# Altium schematic sheet CheetahStack.SchDoc: Title
size Letter; Engineer: David Simmons; Organization: SPAWAR Systems Center Pacific; Address1: 3 Minna Close; Address2: Belrose; Address3: NSW 2085; Address4: Australia; Revision: 1; SheetNumber: 1; SheetTotal: 1; PageSetup: Record=PageOptions|CenterHorizontal=True|CenterVertical=True|PrintScale=0.94|XCorrection=1.00|YCorrection=1.00|PrintKind=0|BorderSize=5000000|LeftOffset=0|BottomOffset=0|Orientation=2|PaperLength=1000|PaperWidth=1000|Scale=100|PaperSource=15|PrintQuality=-3|MediaType=1|DitherType=10|PrintScaleMode=1|PaperKind=A3|PaperIndex=8
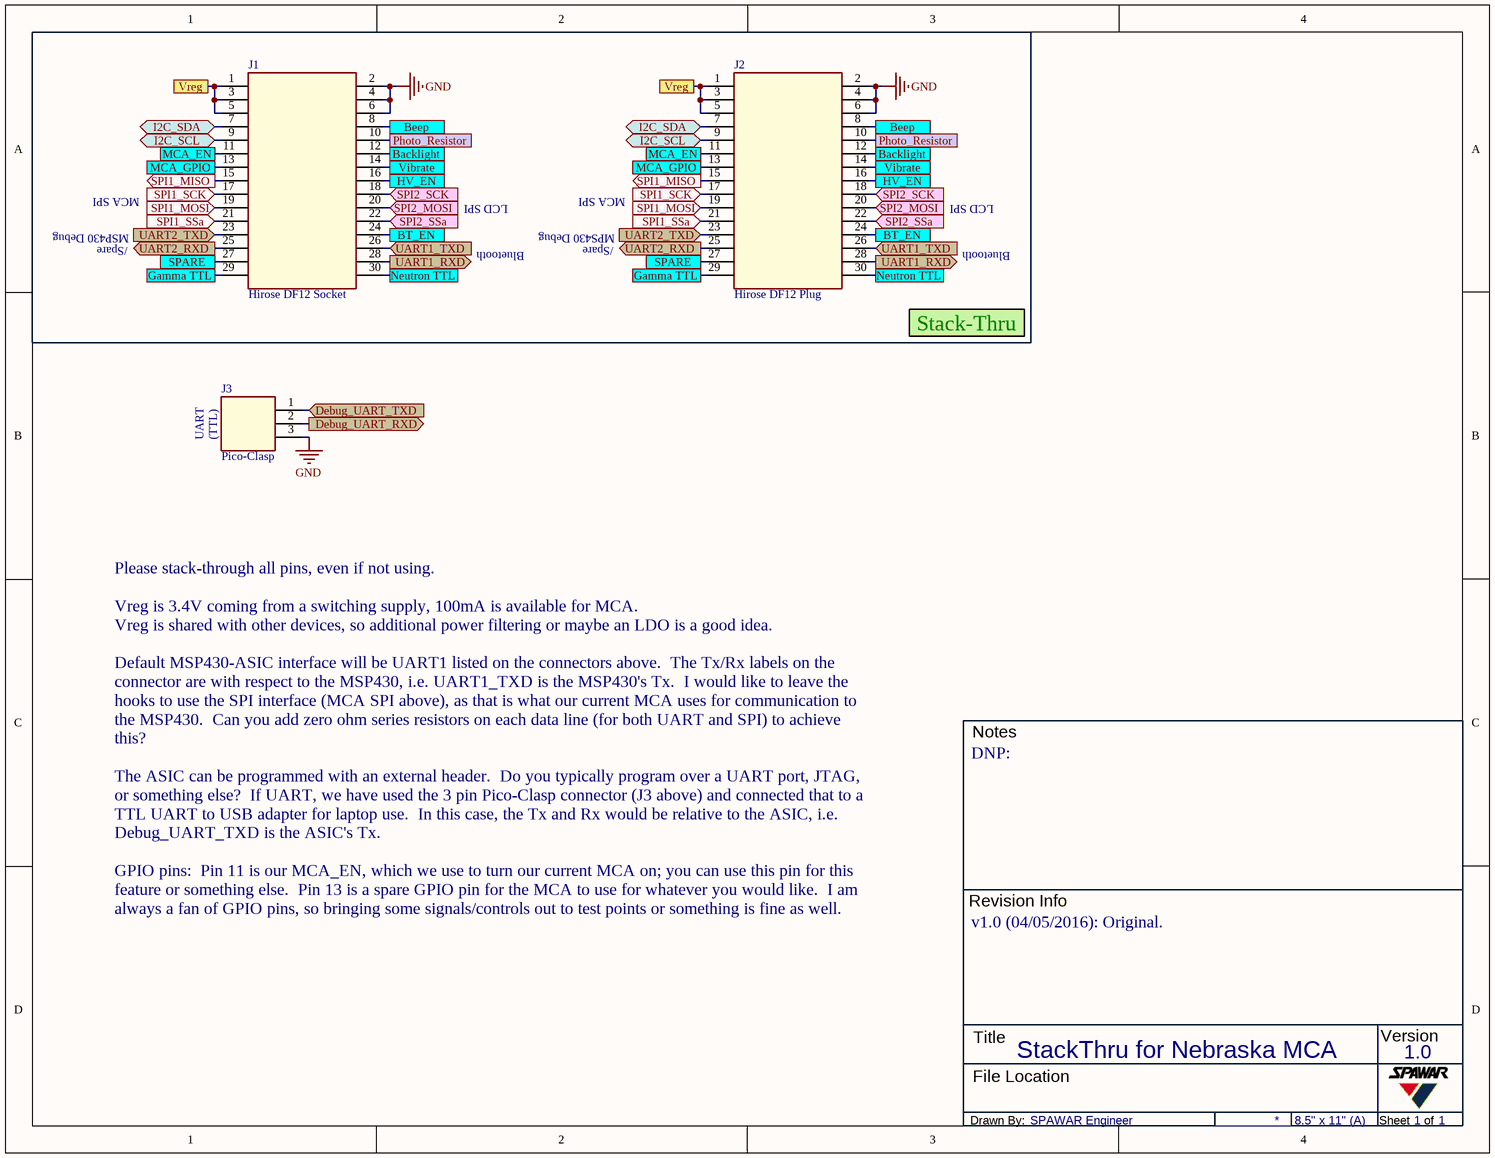
[diagram p0: CheetahStack.SchDoc]

## Parts
J1  Hirose DF12 Socket  [DF12B-30DS-0.5V(86)]
J2  Hirose DF12 Plug  [DF12B(5.0)-30DP-0.5V(86)]
J3  Pico-Clasp  [Molex 1x3 Pin, Pico-Clasp]

## Ports
Backlight, Beep, BT_EN, Debug_UART_RXD, Debug_UART_TXD, Gamma TTL, HV_EN, I2C_SCL, I2C_SDA, MCA_EN, MCA_GPIO, Neutron TTL, Photo_Resistor, SPARE, SPI1_MISO, SPI1_MOSI, SPI1_SCK, SPI1_SSa, SPI2_MOSI, SPI2_SCK, SPI2_SSa, UART1_RXD, UART1_TXD, UART2_RXD, UART2_TXD, Vibrate, Vreg

## Nets
GND: J1.2 J1.4 J1.6 J2.2 J2.4 J2.6 J3.3
Backlight: J1.12 J2.12 ; port Backlight
Beep: J1.8 J2.8 ; port Beep
BT_EN: J1.24 J2.24 ; port BT_EN
Debug_UART_RXD: J3.2 ; port Debug_UART_RXD
Debug_UART_TXD: J3.1 ; port Debug_UART_TXD
Gamma TTL: J1.29 J2.29 ; port Gamma TTL
HV_EN: J1.16 J2.16 ; port HV_EN
I2C_SCL: J1.9 J2.9 ; port I2C_SCL
I2C_SDA: J1.7 J2.7 ; port I2C_SDA
MCA_EN: J1.11 J2.11 ; port MCA_EN
MCA_GPIO: J1.13 J2.13 ; port MCA_GPIO
Neutron TTL: J1.30 J2.30 ; port Neutron TTL
Photo_Resistor: J1.10 J2.10 ; port Photo_Resistor
SPARE: J1.27 J2.27 ; port SPARE
SPI1_MISO: J1.15 J2.15 ; port SPI1_MISO
SPI1_MOSI: J1.19 J2.19 ; port SPI1_MOSI
SPI1_SCK: J1.17 J2.17 ; port SPI1_SCK
SPI1_SSa: J1.21 J2.21 ; port SPI1_SSa
SPI2_MOSI: J1.20 J2.20 ; port SPI2_MOSI
SPI2_SCK: J1.18 J2.18 ; port SPI2_SCK
SPI2_SSa: J1.22 J2.22 ; port SPI2_SSa
UART1_RXD: J1.28 J2.28 ; port UART1_RXD
UART1_TXD: J1.26 J2.26 ; port UART1_TXD
UART2_RXD: J1.25 J2.25 ; port UART2_RXD
UART2_TXD: J1.23 J2.23 ; port UART2_TXD
Vibrate: J1.14 J2.14 ; port Vibrate
Vreg: J1.1 J1.3 J1.5 J2.1 J2.3 J2.5 ; port Vreg

## Notes on the sheet
- MSP430 Debug
- MCA SPI
- LCD SPI
- MPS430 Debug
- /Spare
- Bluetooth
- Stack-Thru
- UART
- (TTL)
- Notes
- DNP:
- Revision Info
- Please stack-through all pins, even if not using.
  Vreg is 3.4V coming from a switching supply, 100mA is available for MCA.
  Vreg is shared with other devices, so additional power filtering or maybe an LDO is a good idea.
  Default MSP430-ASIC interface will be UART1 listed on the connectors above.  The Tx/Rx labels on the connector are with respect to the MSP430, i.e. UART1_TXD is the MSP430's Tx.  I would like to leave the hooks to use the SPI interface (MCA SPI above), as that is what our current MCA uses for communication to the MSP430.  Can you add zero ohm series resistors on each data line (for both UART and SPI) to achieve this?
  The ASIC can be programmed with an external header.  Do you typically program over a UART port, JTAG, or something else?  If UART, we have used the 3 pin Pico-Clasp connector (J3 above) and connected that to a TTL UART to USB adapter for laptop use.  In this case, the Tx and Rx would be relative to the ASIC, i.e. Debug_UART_TXD is the ASIC's Tx.
  GPIO pins:  Pin 11 is our MCA_EN, which we use to turn our current MCA on; you can use this pin for this feature or something else.  Pin 13 is a spare GPIO pin for the MCA to use for whatever you would like.  I am always a fan of GPIO pins, so bringing some signals/controls out to test points or something is fine as well.
- v1.0 (04/05/2016): Original.
- Title
- StackThru for Nebraska MCA
- 1.0
- Version
- Drawn By:
- SPAWAR Engineer
- File Location
- 8.5" x 11" (A)
- Sheet
- 1
- of

## Library data of the parts
J1 = Conn, Hirose, 2x15 Pin, DF12, Socket, Vert, SMT, with metal fitting: Dist Part: 798-DF12B30DS05V86; Cost ($): 1.24; Manufacturer: Hirose; Manf Part: DF12B-30DS-0.5V(86); Distributor: Mouser
J2 = Conn, Hirose, 2x15 Pin, DF12, Plug, Vert, SMT, 5.0mm, with metal fitting: Dist Part: 798-DF12B5030DP05V86; Cost ($): 1.49; Manufacturer: Hirose; Manf Part: DF12B(5.0)-30DP-0.5V(86); Distributor: Mouser
J3 = Conn, Molex, 1x3 Pin, Pico-Clasp, Horz: Dist Part: WM7894CT-ND; Manf Part: 501568-0307; Cost ($): 0.73; Manufacturer: Molex; Distributor: Digi-Key